# EAGLE design ledstick (EAGLE 7.2.0)
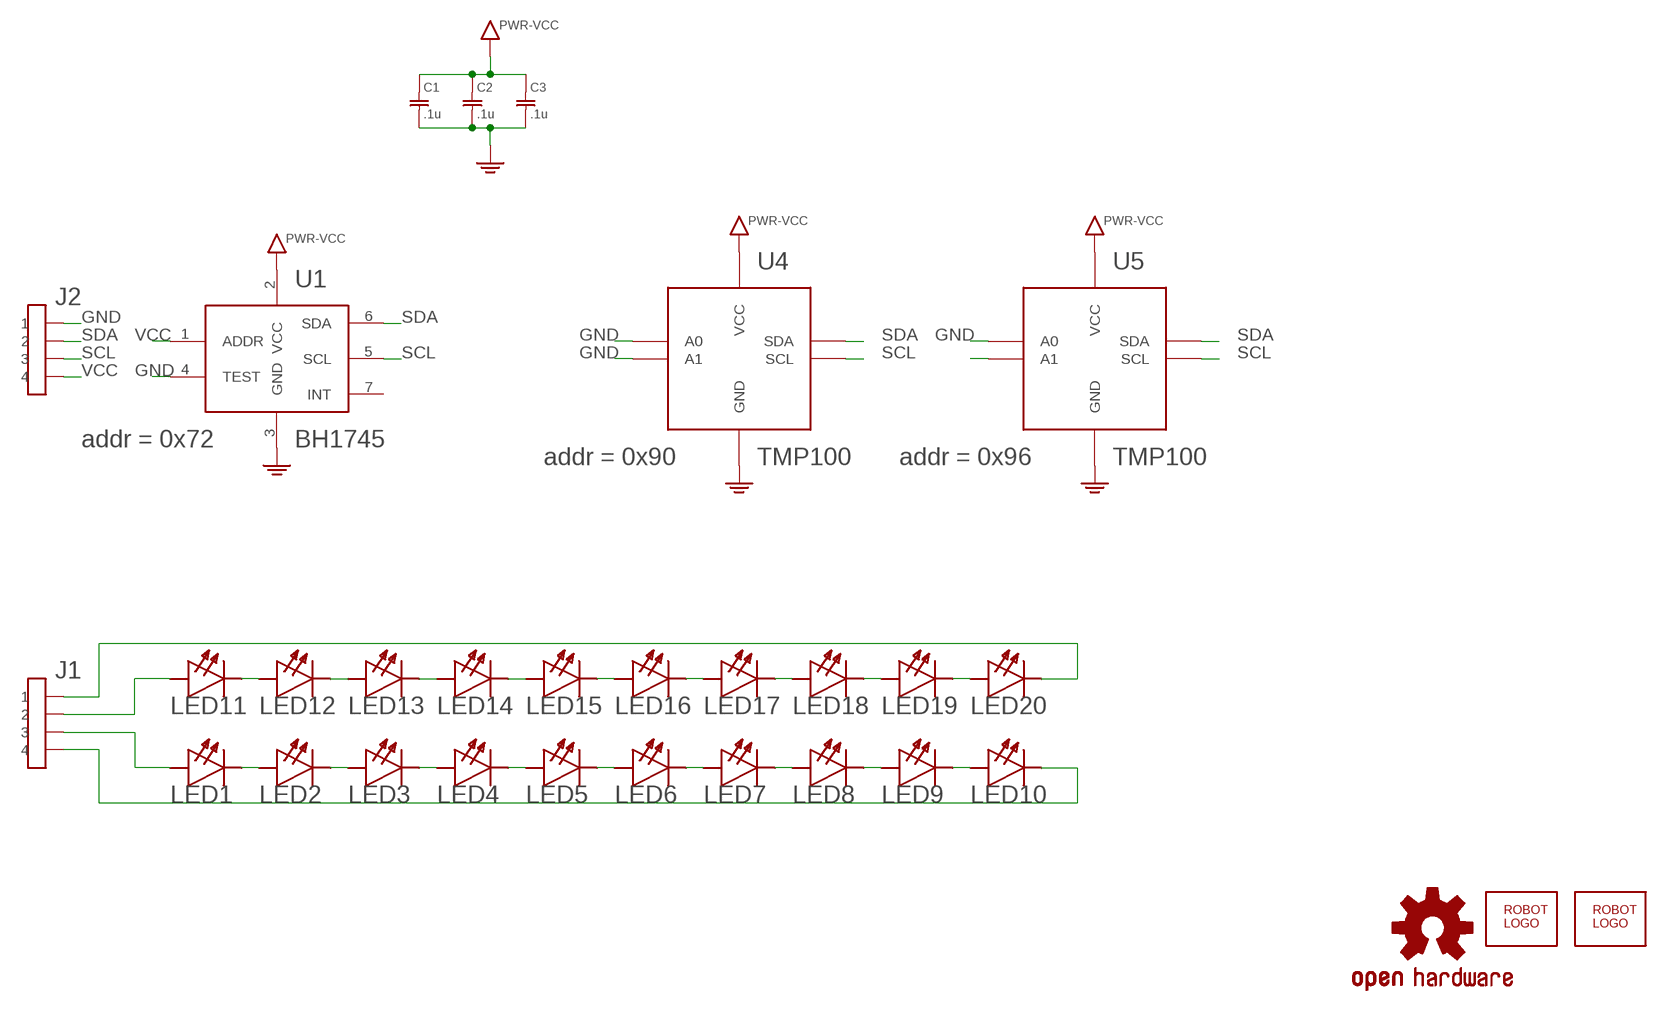
[diagram p0: schematic, sheet 1]

## Parts
C1  .1u  C0603  [SMD0603]
C2  .1u  C0603  [SMD0603]
C3  .1u  C0603  [SMD0603]
J1  HEADER-4X1-PTH  [HEADER-4X1-PTH]
J2  HEADER-4X1-PTH  [HEADER-4X1-PTH]
LED1  W  LED-L4-P1A  [LED4-4P1A]
LED2  W  LED-L4-P1A  [LED4-4P1A]
LED3  W  LED-L4-P1A  [LED4-4P1A]
LED4  W  LED-L4-P1A  [LED4-4P1A]
LED5  W  LED-L4-P1A  [LED4-4P1A]
LED6  W  LED-L4-P1A  [LED4-4P1A]
LED7  W  LED-L4-P1A  [LED4-4P1A]
LED8  W  LED-L4-P1A  [LED4-4P1A]
LED9  W  LED-L4-P1A  [LED4-4P1A]
LED10  W  LED-L4-P1A  [LED4-4P1A]
LED11  C  LED-L4-P1A  [LED4-4P1A]
LED12  C  LED-L4-P1A  [LED4-4P1A]
LED13  C  LED-L4-P1A  [LED4-4P1A]
LED14  C  LED-L4-P1A  [LED4-4P1A]
LED15  C  LED-L4-P1A  [LED4-4P1A]
LED16  C  LED-L4-P1A  [LED4-4P1A]
LED17  C  LED-L4-P1A  [LED4-4P1A]
LED18  C  LED-L4-P1A  [LED4-4P1A]
LED19  C  LED-L4-P1A  [LED4-4P1A]
LED20  C  LED-L4-P1A  [LED4-4P1A]
LOGO1  OSHW-LOGOM  [OSHW-LOGO-M]
U1  BH1745  [WSON8]
U4  TMP100  [SOT-23-6]
U5  TMP100  [SOT-23-6]
U$1  ROBOTMAN-LOGO  [ROBOTMAN-LOGO]
U$2  ROBOTMAN-LOGO  [ROBOTMAN-LOGO]

## Nets
GND: C1.2 C2.2 C3.2 J2.P$1 U1.3(GND) U1.4(TEST) U4.2(GND) U4.3(A1) U4.5(A0) U5.2(GND) U5.5(A0) ; supply symbol labelled PWR-GND
N$1: LED1.C LED2.A LED2.AP(A)
N$2: LED2.C LED3.A LED3.AP(A)
N$3: LED3.C LED4.A LED4.AP(A)
N$4: LED4.C LED5.A LED5.AP(A)
N$5: LED5.C LED6.A LED6.AP(A)
N$6: LED6.C LED7.A LED7.AP(A)
N$7: LED7.C LED8.A LED8.AP(A)
N$8: LED8.C LED9.A LED9.AP(A)
N$9: LED9.C LED10.A LED10.AP(A)
N$10: LED11.C LED12.A LED12.AP(A)
N$11: LED12.C LED13.A LED13.AP(A)
N$12: LED13.C LED14.A LED14.AP(A)
N$13: LED14.C LED15.A LED15.AP(A)
N$14: LED15.C LED16.A LED16.AP(A)
N$15: LED16.C LED17.A LED17.AP(A)
N$16: LED17.C LED18.A LED18.AP(A)
N$17: LED18.C LED19.A LED19.AP(A)
N$18: LED19.C LED20.A LED20.AP(A)
N$19: J1.P$2 LED11.A LED11.AP(A)
N$20: J1.P$3 LED1.A LED1.AP(A)
N$21: J1.P$1 LED20.C
N$22: J1.P$4 LED10.C
N$24: U5.3(A1)
SCL: J2.P$3 U1.5(SCL) U4.1(SCL) U5.1(SCL)
SDA: J2.P$2 U1.6(SDA) U4.6(SDA) U5.6(SDA)
VCC: C1.1 C2.1 C3.1 J2.P$4 U1.1(ADDR) U1.2(VCC) U4.4(VCC) U5.4(VCC) ; supply symbol labelled PWR-VCC
Unconnected: U1.7(INT)

## Notes on the sheet
- addr = 0x72
- addr = 0x90 | addr = 0x96

## Library data of the parts
C1-C3 = jaw:C
J1 J2 = jaw:HEADER-4X1
LED1-LED20 = jaw:LED
LOGO1 = SparkFun-Aesthetics:OSHW-LOGO: Open Source Hardware Logo This logo indicates the piece of hardware it is found on incorporates a OSHW license and/or adheres to the definition of open source hardware found here: http://freedomdefined.org/OSHW
U1 = jaw:BH1745
U4 U5 = jaw:TMP100
U$1 U$2 = jaw:ROBOTMAN-LOGO

## Board
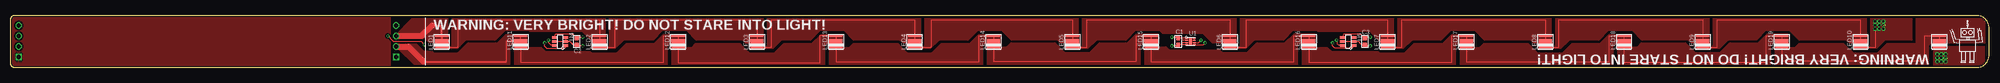
[diagram p1: board, top side]
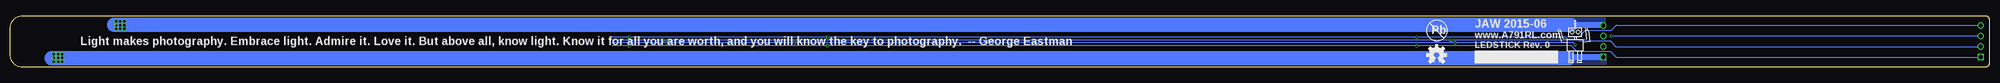
[diagram p2: board, bottom side, seen from below]

Size 477 x 12.5 mm. Coordinates in mm from the lower left corner, seen from the top.
Outline: 474,12.5 1,12.5 arc90 0,11.5 0,1 arc90 1,0 474,0 arc90 477,3 477,9.5 arc90 474,12.5
Copper layers (1*16): Top 0.0356mm / dielectric 1.5011mm / Bottom 0.0356mm
Design rules "LaenPCBOrder": minimum track width 6mil, minimum drill 13mil, track to track 6mil, track to pad 6mil, pad to pad 6mil, via to via 6mil, smd to smd 6mil, copper to edge 15mil, drill to drill 6mil, minimum pad ring 7mil, minimum via ring 7mil, stop-mask expansion 4mil, vias tented up to drill 0mil, thermal gap 10mil

### Footprints (pad centres in the part's own frame; a part is rotated, then mirrored left to right if it is on the bottom)
SMD0603 = smd 0.9 x 0.9: 1 -0.8,0; 2 0.8,0
HEADER-4X1-PTH = drill 1.016 square: P$1 0,0 | drill 1.016: P$2 2.54,0; P$3 5.08,0; P$4 7.62,0
LED4-4P1A = smd 0.6 x 3.2: A 1.4,0; C -1.4,0 | smd 1.2 x 3.2: AP 0,0
WSON8 = smd 0.6 x 0.25: 1 -0.9,0.75; 2 -0.9,0.25; 3 -0.9,-0.25; 4 -0.9,-0.75; 5 0.9,-0.75; 6 0.9,-0.25; 7 0.9,0.25; 8 0.9,0.75 | smd 0.75 x 1.5: P$9 0,0
SOT-23-6 = smd 1.2 x 0.6: 1 -1.35,0.95; 2 -1.35,0; 3 -1.35,-0.95; 4 1.35,-0.95; 5 1.35,0; 6 1.35,0.95

### Placement (x,y rotation side)
C1  281.5,6.25 270 top
C2  136.5,6.25 270 top
C3  326.5,6.25 270 top
J1  93,2.5 90 top
J2  2,2.5 90 top
LED1  104,6.25 90 top
LED2  142,6.25 90 top
LED3  180,6.25 90 top
LED4  218,6.25 90 top
LED5  256,6.25 90 top
LED6  294,6.25 90 top
LED7  332,6.25 90 top
LED8  370,6.25 90 top
LED9  408,6.25 90 top
LED10  446,6.25 90 top
LED11  123,6.25 90 top
LED12  161,6.25 90 top
LED13  199,6.25 90 top
LED14  237,6.25 90 top
LED15  275,6.25 90 top
LED16  313,6.25 90 top
LED17  351,6.25 90 top
LED18  389,6.25 90 top
LED19  427,6.25 90 top
LED20  465,6.25 90 top
LOGO1  133.2,3 0 bottom
U1  284.5,6.25 0 top
U4  132.5,6.25 180 top
U5  322.5,6.25 180 top
U$1  99.8,5.6 0 bottom
U$2  471.8,5.5 0 top

### Tracks (layer width: path | path; a pad name or v marks a point on that pad's centre or on a via)
GND  (via drill 0.35)
  Top 0.25: 136.45,5.5 C2.2 | U1.3 282.6,6 282.4,5.8 282.4,5.5 | 326.5,5.5 C3.2 | U1.4 282.4,5.5 | 282.4,5.5 281.55,5.5 C1.2
  Top 0.3: C3.2 325.75,5.45 325.5,5.7 324.95,6.25 U5.2 U5.5 | U4.2 134.85,6.25 135.4,5.7 135.65,5.45 C2.2 | U4.5 U4.2 | U4.3 U4.2
  Top 0.35: C2.2 136.5,5.2 v138,5.2 | C1.2 281.25,5.2 v280,5.2 | C3.2 326.75,5.2 v327.8,5.2
  Bottom 0.3: 332,5.2 v327.8,5.2 v280,5.2 148,5.2 v138,5.2 100.7,5.2 99.3,3.8 91.2,3.8 89.9,2.5 J2.P$1
  pour Top (isolate 0.35): 0,13 91.5,13 91.5,0 0,0
N$1
  Top 0.25: LED1.C 107.9,4.85 107.9,11.5 142,11.5 LED2.A LED2.AP
  pour Top (no thermals): 106.5,11.9 143.4,11.9 143.4,5.8 140.8,5.8 138,8.6 125.3,8.6 125.1,8.8 119.1,8.8 116.9,6.6 109.8,6.6 107.7,4.5 102.6,4.5 102.6,5 106.1,5 106.5,5.4
N$2
  Top 0.25: LED2.C 145.8,4.85 145.8,11.5 180,11.5 LED3.A LED3.AP
  pour Top (no thermals): 144.5,11.9 181.4,11.9 181.4,5.8 177.3,5.8 176.5,6.6 165.3,6.6 163.1,8.8 157.1,8.8 154.9,6.6 147.8,6.6 145.7,4.5 140.6,4.5 140.6,5 144.1,5 144.5,5.4
N$3
  Top 0.25: LED3.C 183.5,4.85 183.5,11.5 218,11.5 LED4.A LED4.AP
  pour Top (no thermals): 182.5,11.9 219.4,11.9 219.4,5.8 215.3,5.8 214.5,6.6 203.3,6.6 201.1,8.8 195.1,8.8 192.9,6.6 185.8,6.6 183.7,4.5 178.6,4.5 178.6,5 182.1,5 182.5,5.4
N$4
  Top 0.25: LED4.C 222,4.85 222,11.5 256,11.5 LED5.A LED5.AP
  pour Top (no thermals): 220.5,11.9 257.4,11.9 257.4,5.8 253.3,5.8 252.5,6.6 241.3,6.6 239.1,8.8 233.1,8.8 230.9,6.6 223.8,6.6 221.7,4.5 216.6,4.5 216.6,5 220.1,5 220.5,5.4
N$5
  Top 0.25: LED5.C 259.5,4.85 259.5,11.5 294,11.5 LED6.A LED6.AP
  pour Top (no thermals): 258.5,11.9 295.4,11.9 295.4,5.8 289.9,5.8 287.6,8.1 277.8,8.1 277.1,8.8 271.1,8.8 268.9,6.6 261.8,6.6 259.7,4.5 254.6,4.5 254.6,5 258.1,5 258.5,5.4
N$6
  Top 0.25: LED6.C 298,4.85 298,11.5 332,11.5 LED7.A LED7.AP
  pour Top (no thermals): 296.5,11.9 333.4,11.9 333.4,5.8 330.6,5.8 327.9,8.6 315.3,8.6 315.1,8.8 309.1,8.8 306.9,6.6 299.8,6.6 297.7,4.5 292.6,4.5 292.6,5 296.1,5 296.5,5.4
N$7
  Top 0.25: LED7.C 335.5,4.85 335.5,11.5 370,11.5 LED8.A LED8.AP
  pour Top (no thermals): 334.5,11.9 371.4,11.9 371.4,5.8 367.3,5.8 366.5,6.6 355.3,6.6 353.1,8.8 347.1,8.8 344.9,6.6 337.8,6.6 335.7,4.5 330.6,4.5 330.6,5 334.1,5 334.5,5.4
N$8
  Top 0.25: LED8.C 373.3,4.85 373.3,11.5 408,11.5 LED9.A LED9.AP
  pour Top (no thermals): 372.5,11.9 409.4,11.9 409.4,5.8 405.3,5.8 404.5,6.6 393.3,6.6 391.1,8.8 385.1,8.8 382.9,6.6 375.8,6.6 373.7,4.5 368.6,4.5 368.6,5 372.1,5 372.5,5.4
N$9
  Top 0.25: LED9.C 411.5,4.85 411.5,11.5 446,11.5 LED10.A LED10.AP
  pour Top (no thermals): 410.5,11.8 447.4,11.8 447.4,5.8 443.4,5.8 442.6,6.6 431.2,6.6 429,8.8 423.1,8.8 420.9,6.6 414,6.6 411.9,4.5 406.6,4.5 406.6,5 410.1,5 410.5,5.4
N$10
  Top 0.25: LED11.C 123,1.2 157.5,1.2 157.5,7.65 LED12.A LED12.AP
  pour Top (no thermals): 121.5,4.9 127.9,4.9 128.9,3.9 139.6,3.9 140.1,3.5 146.2,3.5 148.5,5.8 155.3,5.8 157.5,8 162.5,8 162.5,5.7 158.8,5.7 158.3,5.2 158.3,0.6 121.5,0.6
N$11
  Top 0.25: LED12.C 161,1.1 195.2,1.1 195.2,7.7 199,7.7 LED13.A LED13.AP
  pour Top (no thermals): 159.5,4.9 164.3,4.9 165.2,5.8 175.8,5.8 178.1,3.5 184.2,3.5 186.5,5.8 193.3,5.8 195.5,8 200.5,8 200.5,5.7 196.8,5.7 196.3,5.2 196.3,0.6 159.5,0.6
N$12
  Top 0.25: LED13.C 199,1.4 233.5,1.4 233.5,7.65 LED14.A LED14.AP
  pour Top (no thermals): 197.5,4.9 202.3,4.9 203.2,5.8 213.8,5.8 216.1,3.5 222.2,3.5 224.5,5.8 231.3,5.8 233.5,8 238.5,8 238.5,5.7 234.8,5.7 234.3,5.2 234.3,0.6 197.5,0.6
N$13
  Top 0.25: LED14.C 237,1.5 271.4,1.5 271.4,7.65 LED15.A LED15.AP
  pour Top (no thermals): 235.5,5 240.3,5 241.2,5.9 251.8,5.9 254.1,3.6 260.2,3.6 262.5,5.9 269.3,5.9 271.5,8.1 276.5,8.1 276.5,5.8 272.8,5.8 272.3,5.3 272.3,0.6 235.5,0.6
N$14
  Top 0.25: LED15.C 275,1.4 309.4,1.4 309.4,7.65 LED16.A LED16.AP
  pour Top (no thermals): 273.5,5 278.6,5 279.3,4.3 291.4,4.3 292.1,3.6 298.2,3.6 300.5,5.9 307.3,5.9 309.5,8.1 314.5,8.1 314.5,5.8 310.8,5.8 310.3,5.3 310.3,0.6 273.5,0.6
N$15
  Top 0.25: LED16.C 313,1.3 347.5,1.3 347.5,7.65 LED17.A LED17.AP
  pour Top (no thermals): 311.5,4.9 317.4,4.9 318.4,3.9 329.5,3.9 330.1,3.5 336.2,3.5 338.5,5.8 345.3,5.8 347.5,8 352.5,8 352.5,5.7 348.8,5.7 348.3,5.2 348.3,0.6 311.5,0.6
N$16
  Top 0.25: LED17.C 351,1.4 385.4,1.4 385.4,7.65 LED18.A LED18.AP
  pour Top (no thermals): 349.5,4.9 354.3,4.9 355.2,5.8 365.8,5.8 368.1,3.5 374.2,3.5 376.5,5.8 383.3,5.8 385.5,8 390.5,8 390.5,5.7 386.8,5.7 386.3,5.2 386.3,0.6 349.5,0.6
N$17
  Top 0.25: LED18.C 389,1.3 423.3,1.3 423.3,7.65 LED19.A LED19.AP
  pour Top (no thermals): 387.5,5 392.3,5 393.2,5.9 403.8,5.9 406.1,3.6 412.2,3.6 414.5,5.9 421.3,5.9 423.5,8.1 428.5,8.1 428.5,5.8 424.8,5.8 424.3,5.3 424.3,0.6 387.5,0.6
N$18
  Top 0.25: LED19.C 427,1.6 461.5,1.6 461.5,7.65 LED20.A LED20.AP
  pour Top (no thermals): 459.4,5.8 459.4,11.9 475.9,11.9 475.9,5.8
  pour Top (no thermals): 425.5,4.9 430.3,4.9 431.2,5.8 441.9,5.8 444.2,3.5 450.2,3.5 452.5,5.8 459.3,5.8 461.5,8 466.5,8 466.5,5.7 462.8,5.7 462.3,5.2 462.3,0.6 425.5,0.6
N$19
  Top 0.25: 119.5,1.4 119.5,6.25 LED11.AP LED11.A
  Top 0.5: 99.6,1.4 119.5,1.4
  Top 1.5: J1.P$2 95.96,5.04 99.6,1.4
  pour Top (no thermals): 124.5,8 124.5,5.7 121,5.7 120.4,5.1 120.4,0.6 97.4,0.6 93.5,4.5 93.5,5.7 97.8,5.7 99.5,4 101.5,4 102,3.5 107.9,3.5 110.3,5.9 117.4,5.9 119.5,8
N$20
  Top 0.5: 103.95,6.3 103.95,7.7 103.95,10.08 103.93,10.1 101.7,10.1
  Top 1.5: J1.P$3 99.18,7.58 101.7,10.1
  pour Top (no thermals): 105.4,6 101,6 100,7 97.6,7 93,7.9 96.9,11.8 105.4,11.9
N$21  (via drill 0.5)  (1 unrouted)
  Bottom 1.5: J1.P$1 100.75,2.5 101.4,2.25
  Bottom 3.5: 101.6,2.25 101.4,2.25 467,2.25
  other vias: 464.5,3.2 465.5,3.2 466.5,3.2 466.5,2.3 464.5,2.3 465.5,2.3 464.5,1.4 465.5,1.4 466.5,1.4
  pour Top (no thermals): 463.5,5 463.5,0.6 475.9,0.6 475.9,5
  pour Bottom (no thermals): 92.4,2.5 92.4,0.6 101.9,0.6 102,2.5
N$22  (via drill 0.5)  (1 unrouted)
  Top 0.25: LED10.C 449.7,4.85 449.7,11.5
  Bottom 1.5: J1.P$4 100.77,10.12 100.9,10.25
  Bottom 3.5: 100.9,10.25 452,10.25
  other vias: 451.5,9.3 450.5,9.3 450.5,10.2 451.5,10.2 449.5,11.1 450.5,11.1 451.5,11.1 449.5,10.2 449.5,9.3
  pour Top (no thermals): 447.5,5 448.1,5 448.5,5.4 448.5,11.9 458.4,11.9 458.4,6.6 451.9,6.6 449.9,4.6 447.5,4.6
  pour Bottom (no thermals): 92.5,10 92.5,11.9 101.5,11.9 101.5,10
SCL  (via drill 0.35)
  Top 0.25: U1.5 287.6,5.5 v288,5.9
  Top 0.3: v99.8,5.5 99,6.3 92.3,6.3 v91.02,7.58 | U5.1 323.85,5.05 323.4,4.6 319.3,4.6 318.7,5.2 v318.7,5.9 | U4.1 133.85,4.85 133.5,4.5 129.4,4.5 128.8,5.1 v128.8,5.9
  Bottom 0.3: v99.8,5.5 100.2,5.9 v128.8,5.9 138,5.9 v288,5.9 v318.7,5.9 332,5.9 | v91.02,7.58 J2.P$3
SDA  (via drill 0.35)
  Top 0.25: U1.6 286.4,6 v287,6.6
  Top 0.3: U5.6 320.2,5.3 319.9,5.6 319.9,6.3 319.6,6.6 v319.7,6.6 | U4.6 130.3,5.3 129.7,5.9 v129.7,6.6
  Bottom 0.3: 332,6.6 v319.7,6.6 v287,6.6 139,6.6 v129.7,6.6 100.9,6.6 98.9,6.6 98.6,6.3 91.2,6.3 89.94,5.04 J2.P$2
VCC  (via drill 0.35)
  Top 0.25: 136.45,7 C2.1 | 282.8,6.5 U1.2 282.52,6.5 282.4,6.62 282.4,7 | U1.1 282.4,7 | 282.4,7 281.55,7 C1.1 | 326.45,7 C3.1
  Top 0.3: 326.45,7 326.4,7 325.4,8 321.4,8 321.2,7.8 321.2,7.25 U5.4 | 136.45,7 136.45,7.15 135.6,8 131.4,8 131.2,7.8 131.2,7.25 U4.4
  Top 0.35: C2.1 136.5,7.3 v138,7.3 | C1.1 281.25,7.3 v280,7.3 | C3.1 326.75,7.3 v327.8,7.3
  Bottom 0.3: 332,7.3 v327.8,7.3 v280,7.3 v138,7.3 98.9,7.3 97.4,8.8 91.2,8.8 89.88,10.12 J2.P$4

### Text on the board
tPlace: WARNING: VERY BRIGHT! DO NOT STARE INTO LIGHT! | WARNING: VERY BRIGHT! DO NOT STARE INTO LIGHT!
bPlace: JAW 2015-06 | Pb | www.A791RL.com | LEDSTICK Rev. 0 | Light makes photography. Embrace light. Admire it. Love it. But above all, know light. Know it for all you are worth, and you will know the key to photography. -- George Eastman